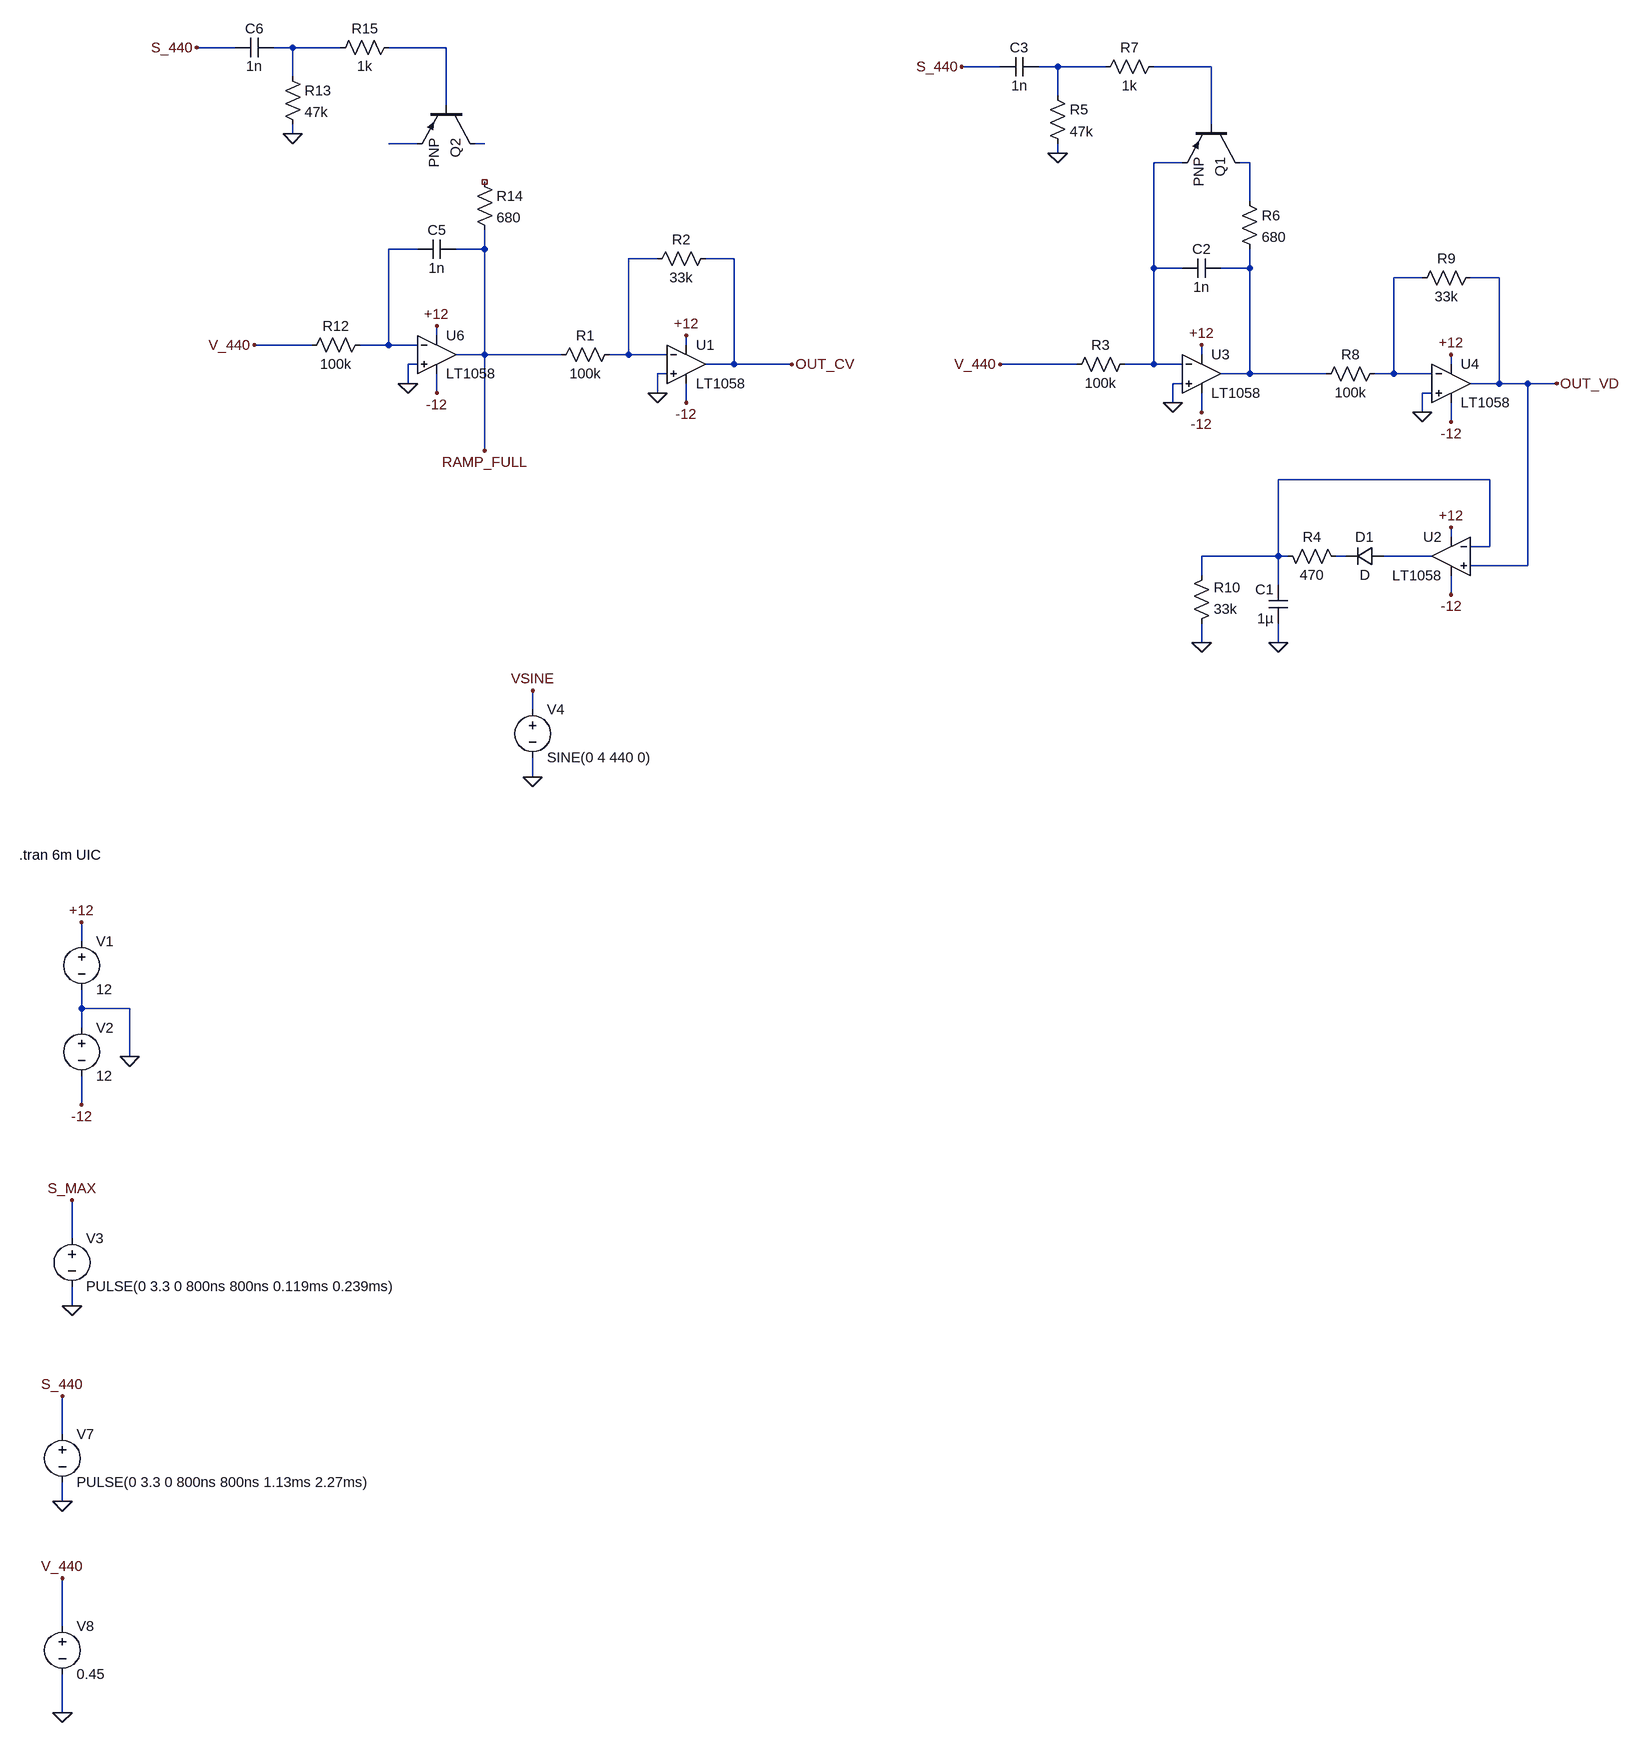
[diagram p0: schematic DCOSim.asc]
DCOSim.asc, the LTspice schematic file:
Version 4
SHEET 1 3600 2576
WIRE 320 -1856 256 -1856
WIRE 416 -1856 384 -1856
WIRE 496 -1856 416 -1856
WIRE 672 -1856 576 -1856
WIRE 2432 -1824 2368 -1824
WIRE 2528 -1824 2496 -1824
WIRE 2608 -1824 2528 -1824
WIRE 2784 -1824 2688 -1824
WIRE 416 -1808 416 -1856
WIRE 2528 -1776 2528 -1824
WIRE 672 -1760 672 -1856
WIRE 2784 -1728 2784 -1824
WIRE 416 -1712 416 -1728
WIRE 624 -1696 576 -1696
WIRE 736 -1696 720 -1696
WIRE 2528 -1680 2528 -1696
WIRE 2736 -1664 2688 -1664
WIRE 2848 -1664 2832 -1664
WIRE 2848 -1600 2848 -1664
WIRE 624 -1520 576 -1520
WIRE 736 -1520 736 -1552
WIRE 736 -1520 688 -1520
WIRE 1024 -1504 976 -1504
WIRE 1152 -1504 1104 -1504
WIRE 2688 -1488 2688 -1664
WIRE 2736 -1488 2688 -1488
WIRE 2848 -1488 2848 -1520
WIRE 2848 -1488 2800 -1488
WIRE 3136 -1472 3088 -1472
WIRE 3264 -1472 3216 -1472
WIRE 656 -1376 656 -1392
WIRE 448 -1360 352 -1360
WIRE 576 -1360 576 -1520
WIRE 576 -1360 528 -1360
WIRE 624 -1360 576 -1360
WIRE 1072 -1360 1072 -1376
WIRE 736 -1344 736 -1520
WIRE 736 -1344 688 -1344
WIRE 864 -1344 736 -1344
WIRE 976 -1344 976 -1504
WIRE 976 -1344 944 -1344
WIRE 1040 -1344 976 -1344
WIRE 2768 -1344 2768 -1360
WIRE 624 -1328 608 -1328
WIRE 1152 -1328 1152 -1504
WIRE 1152 -1328 1104 -1328
WIRE 1248 -1328 1152 -1328
WIRE 2560 -1328 2432 -1328
WIRE 2688 -1328 2688 -1488
WIRE 2688 -1328 2640 -1328
WIRE 2736 -1328 2688 -1328
WIRE 3184 -1328 3184 -1344
WIRE 1040 -1312 1024 -1312
WIRE 2848 -1312 2848 -1488
WIRE 2848 -1312 2800 -1312
WIRE 2976 -1312 2848 -1312
WIRE 3088 -1312 3088 -1472
WIRE 3088 -1312 3056 -1312
WIRE 3152 -1312 3088 -1312
WIRE 608 -1296 608 -1328
WIRE 2736 -1296 2720 -1296
WIRE 3264 -1296 3264 -1472
WIRE 3264 -1296 3216 -1296
WIRE 3312 -1296 3264 -1296
WIRE 3360 -1296 3312 -1296
WIRE 656 -1280 656 -1312
WIRE 1024 -1280 1024 -1312
WIRE 3152 -1280 3136 -1280
WIRE 1072 -1264 1072 -1296
WIRE 2720 -1264 2720 -1296
WIRE 2768 -1248 2768 -1280
WIRE 3136 -1248 3136 -1280
WIRE 3184 -1232 3184 -1264
WIRE 736 -1184 736 -1344
WIRE 3248 -1136 2896 -1136
WIRE 3312 -992 3312 -1296
WIRE 3184 -1040 3184 -1056
WIRE 3248 -1024 3248 -1136
WIRE 3248 -1024 3216 -1024
WIRE 2896 -1008 2896 -1136
WIRE 2896 -1008 2768 -1008
WIRE 2912 -1008 2896 -1008
WIRE 3008 -1008 2992 -1008
WIRE 3152 -1008 3072 -1008
WIRE 3312 -992 3216 -992
WIRE 2768 -976 2768 -1008
WIRE 2896 -960 2896 -1008
WIRE 3184 -944 3184 -976
WIRE 2768 -864 2768 -896
WIRE 2896 -864 2896 -896
WIRE 816 -752 816 -784
WIRE 816 -640 816 -672
WIRE 64 256 64 224
WIRE 64 368 64 336
WIRE 144 368 64 368
WIRE 64 400 64 368
WIRE 144 448 144 368
WIRE 64 528 64 480
WIRE 48 768 48 704
WIRE 48 880 48 848
WIRE 32 2096 32 2032
WIRE 32 2208 32 2176
WIRE 32 2416 32 2336
WIRE 32 2560 32 2496
FLAG 64 224 +12
FLAG 64 528 -12
FLAG 144 448 0
FLAG 48 880 0
FLAG 48 704 S_MAX
FLAG 32 2208 0
FLAG 32 2032 S_440
FLAG 32 2336 V_440
FLAG 32 2560 0
FLAG 656 -1392 +12
FLAG 656 -1280 -12
FLAG 256 -1856 S_440
FLAG 608 -1296 0
FLAG 416 -1712 0
FLAG 352 -1360 V_440
FLAG 1072 -1376 +12
FLAG 1072 -1264 -12
FLAG 1024 -1280 0
FLAG 1248 -1328 OUT_CV
FLAG 2768 -1360 +12
FLAG 2768 -1248 -12
FLAG 2368 -1824 S_440
FLAG 2720 -1264 0
FLAG 2528 -1680 0
FLAG 3184 -1344 +12
FLAG 3184 -1232 -12
FLAG 3136 -1248 0
FLAG 3360 -1296 OUT_VD
FLAG 2432 -1328 V_440
FLAG 3184 -1056 +12
FLAG 3184 -944 -12
FLAG 2896 -864 0
FLAG 2768 -864 0
FLAG 736 -1184 RAMP_FULL
FLAG 816 -640 0
FLAG 816 -784 VSINE
SYMBOL voltage 64 240 R0
SYMATTR InstName V1
SYMATTR Value 12
SYMBOL voltage 64 384 R0
SYMATTR InstName V2
SYMATTR Value 12
SYMBOL voltage 48 752 R0
SYMATTR InstName V3
SYMATTR Value PULSE(0 3.3 0 800ns 800ns 0.119ms 0.239ms)
SYMBOL voltage 32 2080 R0
SYMATTR InstName V7
SYMATTR Value PULSE(0 3.3 0 800ns 800ns 1.13ms 2.27ms)
SYMBOL voltage 32 2400 R0
SYMATTR InstName V8
SYMATTR Value 0.45
SYMBOL OpAmps/LT1058 656 -1408 R0
SYMATTR InstName U6
SYMBOL cap 688 -1536 R90
WINDOW 0 0 32 VBottom 2
WINDOW 3 32 32 VTop 2
SYMATTR InstName C5
SYMATTR Value 1n
SYMBOL res 544 -1376 R90
WINDOW 0 0 56 VBottom 2
WINDOW 3 32 56 VTop 2
SYMATTR InstName R12
SYMATTR Value 100k
SYMBOL cap 384 -1872 R90
WINDOW 0 0 32 VBottom 2
WINDOW 3 32 32 VTop 2
SYMATTR InstName C6
SYMATTR Value 1n
SYMBOL res 400 -1824 R0
SYMATTR InstName R13
SYMATTR Value 47k
SYMBOL res 720 -1648 R0
SYMATTR InstName R14
SYMATTR Value 680
SYMBOL res 592 -1872 R90
WINDOW 0 0 56 VBottom 2
WINDOW 3 32 56 VTop 2
SYMATTR InstName R15
SYMATTR Value 1k
SYMBOL pnp 720 -1760 R90
SYMATTR InstName Q2
SYMBOL OpAmps/LT1058 1072 -1392 R0
SYMATTR InstName U1
SYMBOL res 960 -1360 R90
WINDOW 0 0 56 VBottom 2
WINDOW 3 32 56 VTop 2
SYMATTR InstName R1
SYMATTR Value 100k
SYMBOL res 1120 -1520 R90
WINDOW 0 0 56 VBottom 2
WINDOW 3 32 56 VTop 2
SYMATTR InstName R2
SYMATTR Value 33k
SYMBOL OpAmps/LT1058 2768 -1376 R0
SYMATTR InstName U3
SYMBOL cap 2800 -1504 R90
WINDOW 0 0 32 VBottom 2
WINDOW 3 32 32 VTop 2
SYMATTR InstName C2
SYMATTR Value 1n
SYMBOL res 2656 -1344 R90
WINDOW 0 0 56 VBottom 2
WINDOW 3 32 56 VTop 2
SYMATTR InstName R3
SYMATTR Value 100k
SYMBOL cap 2496 -1840 R90
WINDOW 0 0 32 VBottom 2
WINDOW 3 32 32 VTop 2
SYMATTR InstName C3
SYMATTR Value 1n
SYMBOL res 2512 -1792 R0
SYMATTR InstName R5
SYMATTR Value 47k
SYMBOL res 2832 -1616 R0
SYMATTR InstName R6
SYMATTR Value 680
SYMBOL res 2704 -1840 R90
WINDOW 0 0 56 VBottom 2
WINDOW 3 32 56 VTop 2
SYMATTR InstName R7
SYMATTR Value 1k
SYMBOL pnp 2832 -1728 R90
SYMATTR InstName Q1
SYMBOL OpAmps/LT1058 3184 -1360 R0
SYMATTR InstName U4
SYMBOL res 3072 -1328 R90
WINDOW 0 0 56 VBottom 2
WINDOW 3 32 56 VTop 2
SYMATTR InstName R8
SYMATTR Value 100k
SYMBOL res 3232 -1488 R90
WINDOW 0 0 56 VBottom 2
WINDOW 3 32 56 VTop 2
SYMATTR InstName R9
SYMATTR Value 33k
SYMBOL OpAmps/LT1058 3184 -1072 M0
SYMATTR InstName U2
SYMBOL diode 3072 -992 M270
WINDOW 0 32 32 VTop 2
WINDOW 3 0 32 VBottom 2
SYMATTR InstName D1
SYMBOL res 2896 -1024 M90
WINDOW 0 0 56 VBottom 2
WINDOW 3 32 56 VTop 2
SYMATTR InstName R4
SYMATTR Value 470
SYMBOL cap 2912 -960 M0
SYMATTR InstName C1
SYMATTR Value 1µ
SYMBOL res 2752 -880 M180
WINDOW 0 36 76 Left 2
WINDOW 3 36 40 Left 2
SYMATTR InstName R10
SYMATTR Value 33k
SYMBOL voltage 816 -768 R0
SYMATTR InstName V4
SYMATTR Value SINE(0 4 440 0)
TEXT -40 112 Left 2 !.tran 6m UIC

The netlist it stands for:
* DCOSim.asc
V1 +12 0 12
V2 0 -12 12
V3 S_MAX 0 PULSE(0 3.3 0 800ns 800ns 0.119ms 0.239ms)
V7 S_440 0 PULSE(0 3.3 0 800ns 800ns 1.13ms 2.27ms)
V8 V_440 0 0.45
XU6 0 N009 +12 -12 RAMP_FULL LT1057  ; LT1058, pins In+ In- V+ V- OUT
C5 RAMP_FULL N009 1n
R12 N009 V_440 100k
C6 N001 S_440 1n
R13 N001 0 47k
R14 NC_01 RAMP_FULL 680
R15 N002 N001 1k
Q2 N006 N002 N005 0 PNP
XU1 0 N010 +12 -12 OUT_CV LT1057  ; LT1058, pins In+ In- V+ V- OUT
R1 N010 RAMP_FULL 100k
R2 OUT_CV N010 33k
XU3 0 N007 +12 -12 N011 LT1057  ; LT1058, pins In+ In- V+ V- OUT
C2 N011 N007 1n
R3 N007 V_440 100k
C3 N003 S_440 1n
R5 N003 0 47k
R6 N008 N011 680
R7 N004 N003 1k
Q1 N008 N004 N007 0 PNP
XU4 0 N012 +12 -12 OUT_VD LT1057  ; LT1058, pins In+ In- V+ V- OUT
R8 N012 N011 100k
R9 OUT_VD N012 33k
XU2 OUT_VD N013 +12 -12 N015 LT1057  ; LT1058, pins In+ In- V+ V- OUT
D1 N015 N014 D
R4 N013 N014 470
C1 N013 0 1µ
R10 0 N013 33k
V4 VSINE 0 SINE(0 4 440 0)
.model D D
.lib standard.dio
.model NPN NPN
.model PNP PNP
.lib standard.bjt
.tran 6m UIC
.lib LTC.lib
.backanno
.end